# EAGLE design Mechaduino01 (EAGLE 7.3.0)
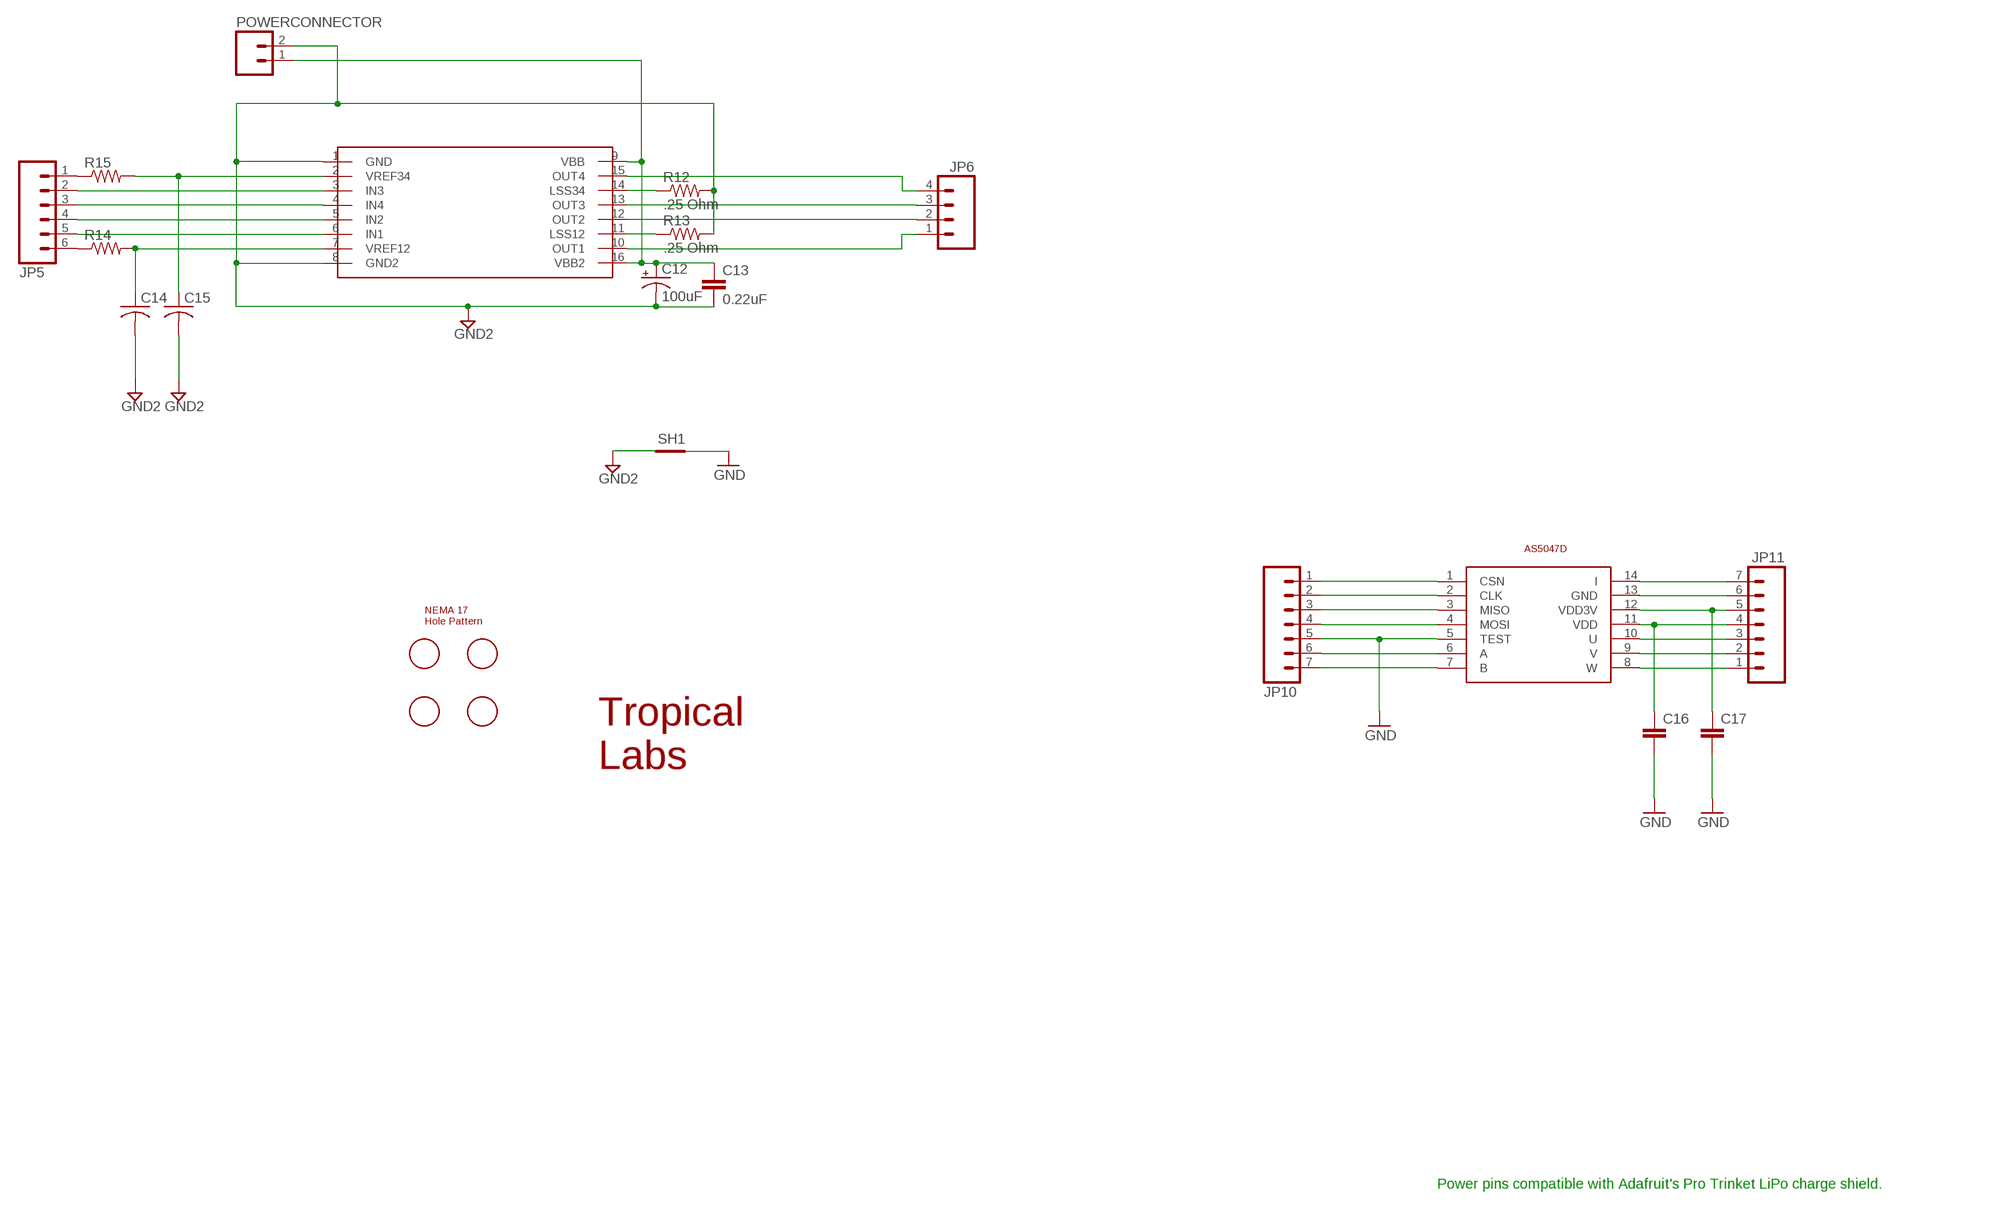
[diagram p0: schematic, sheet 1, part 1 of 2]
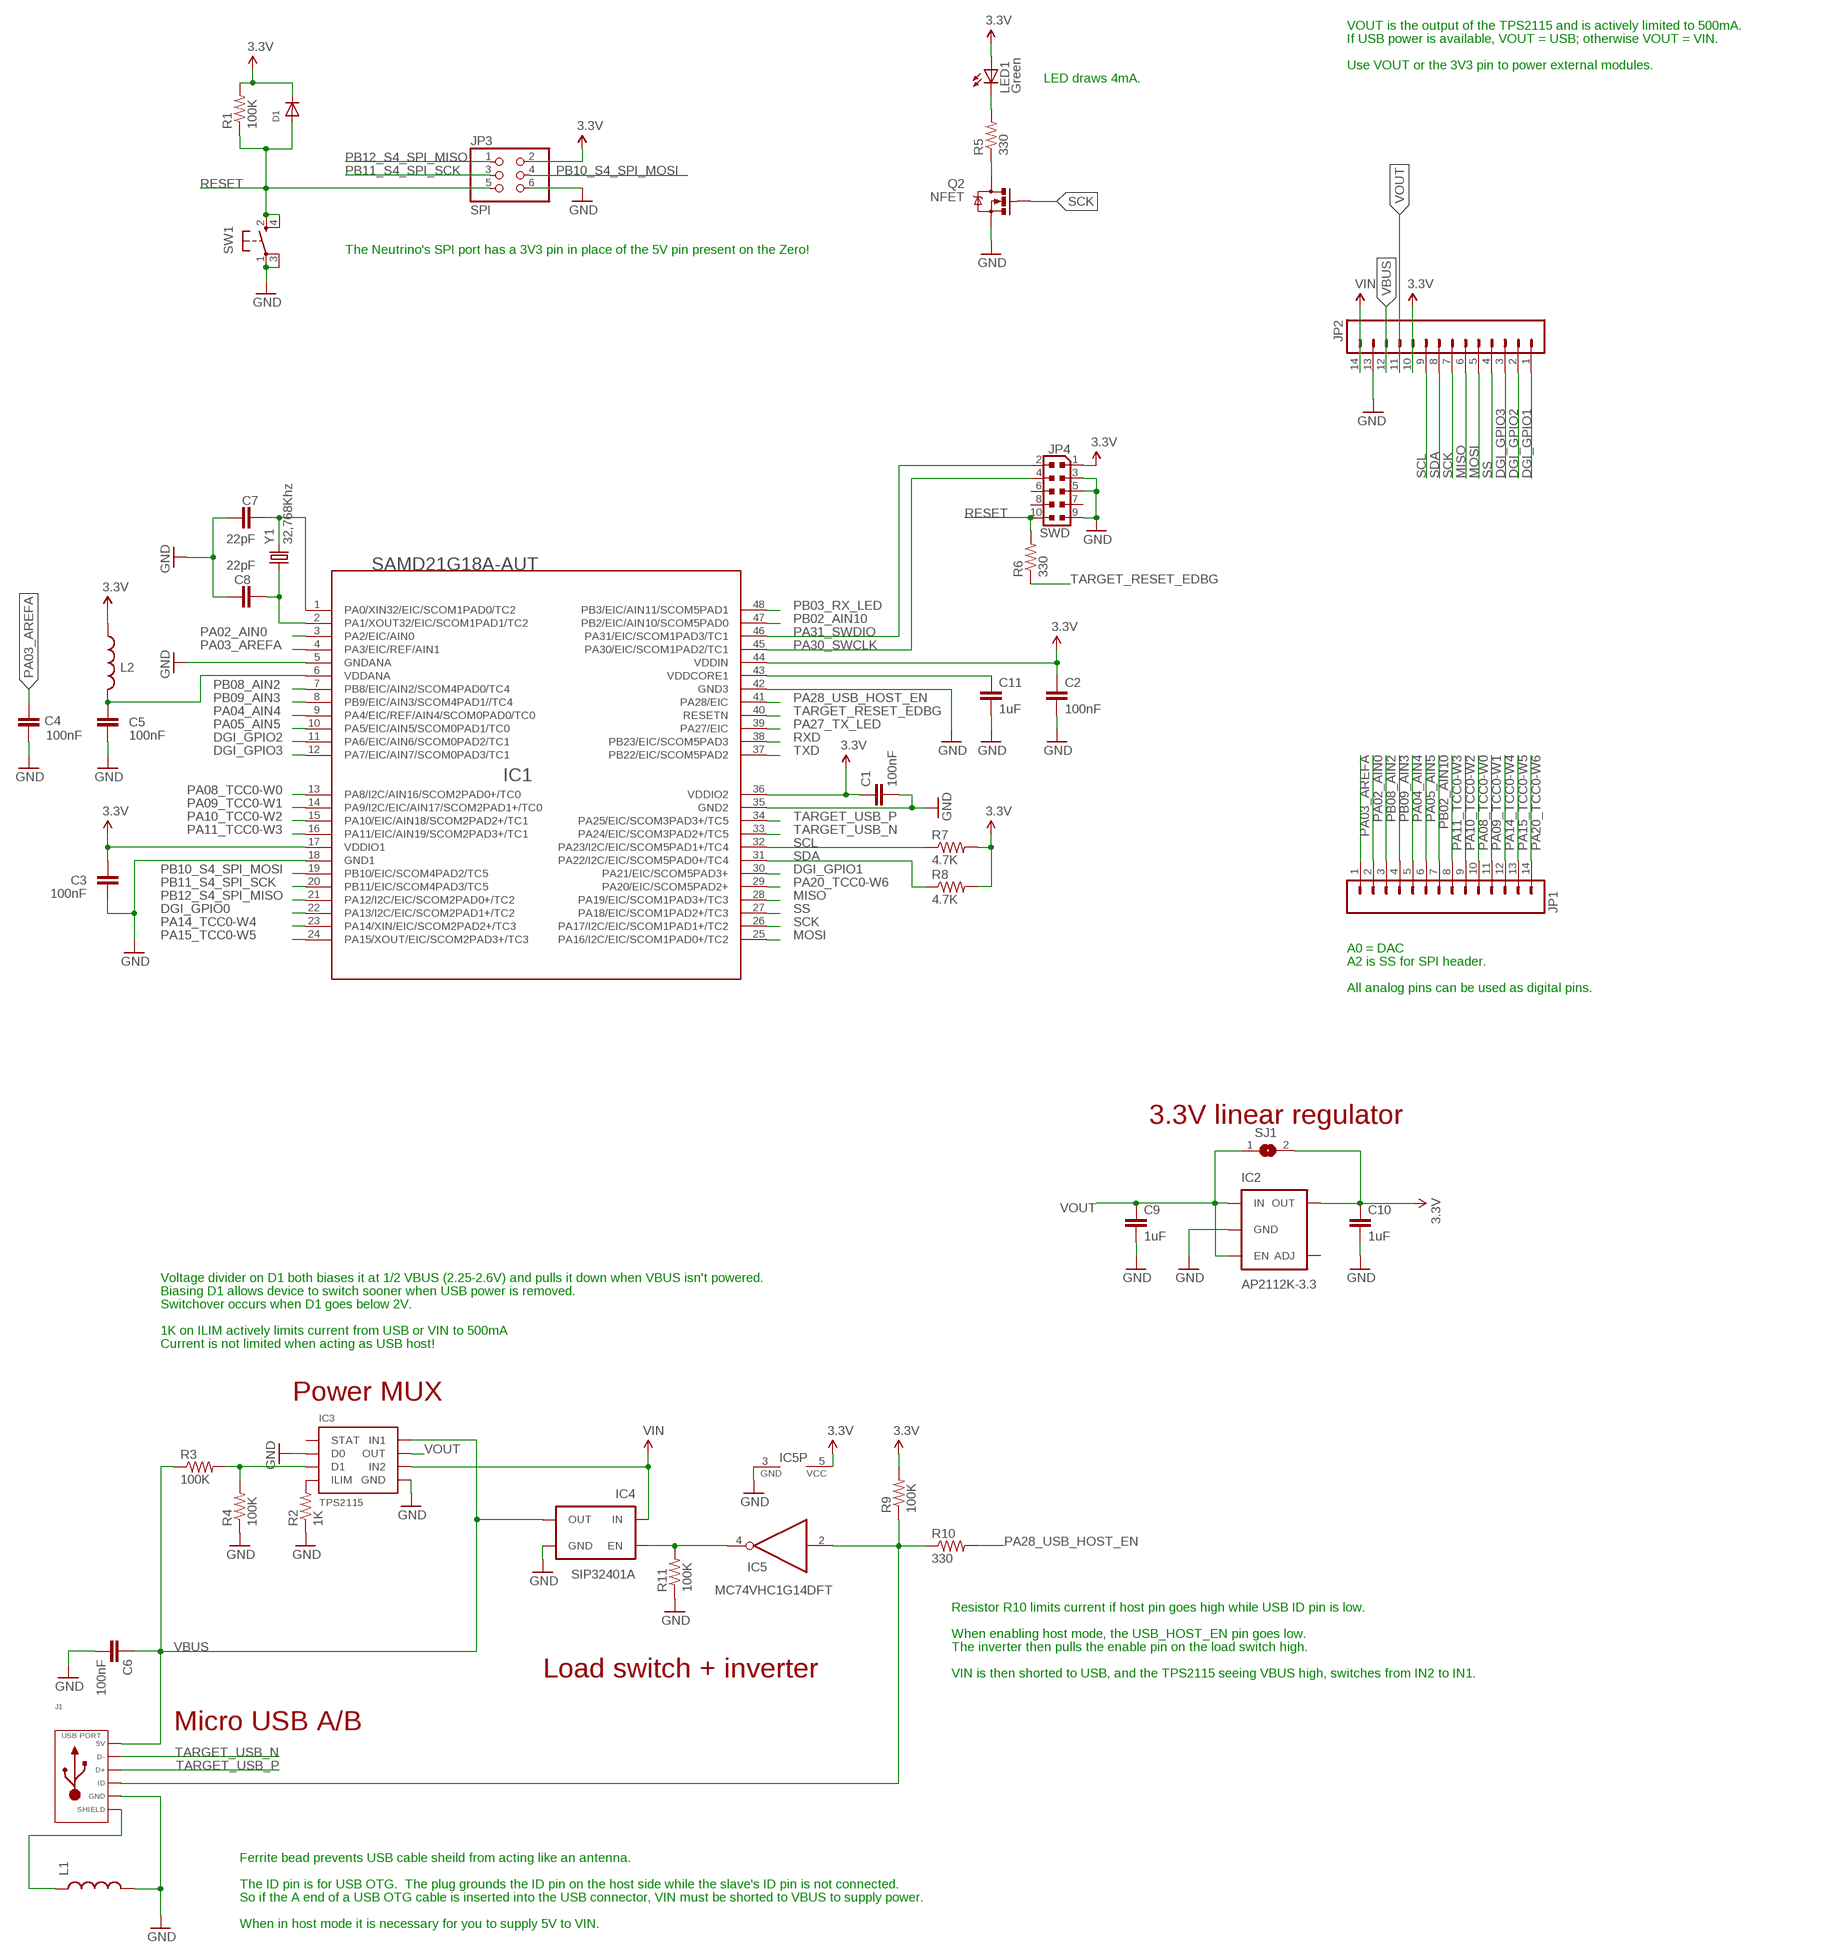
[diagram p1: schematic, sheet 1, part 2 of 2]

## Parts
C1  100nF  CAP0402  [0402-CAP]
C2  100nF  CAP0402  [0402-CAP]
C3  100nF  CAP0402  [0402-CAP]
C4  100nF  CAP0402  [0402-CAP]
C5  100nF  CAP0402  [0402-CAP]
C6  100nF  CAP0402  [0402-CAP]
C7  22pF  CAP0402  [0402-CAP]
C8  22pF  CAP0402  [0402-CAP]
C9  1uF  CAP0402  [0402-CAP]
C10  1uF  CAP0402  [0402-CAP]
C11  1uF  CAP0402  [0402-CAP]
C12  100uF  CAP_POLPTH1  [CPOL-RADIAL-100UF-25V]
C13  0.22uF  CAPEZ  [CAP-PTH-SMALLEZ]
C14  C-US050-035X075  [C050-035X075]
C15  C-US050-035X075  [C050-035X075]
C16  CAP0402  [0402-CAP]
C17  CAP0402  [0402-CAP]
D1  DIODESOD-523  [SOD-523]
IC1  SAMD21G18A-AUT  INTEGRATEDCIRCUITS_1792_SAMD21G18A-AUT  [INTEGRATEDCIRCUITS_TQFP48-7X7]
IC2  AP2112K-3.3  AP2202-ADJ  [SOT23-5]
IC3  TPS2115  [8-VDFN]
IC4  SIP32401A  [TDFN4]
IC5  MC74VHC1G14DFT  74AHC1G04DCK  [SC70-5]
J1  USB_MICRO_RIGHT  [MICROUSB-RIGHT]
JP1  M14NOSILK_SMALLPADS  [1X14_NO_SILK_SMALLPADS]
JP2  M14NOSILK_SMALLPADS  [1X14_NO_SILK_SMALLPADS]
JP3  SPI  CONNETTORI_0114_PH254-203DF118A00V  [CONNETTORI_2X03]
JP4  SWD  CONNETTORI_0171_PH127-205DF055G00A  [CONNETTORI_PINHEAD-2X5-P127]
JP5  M06SILK_FEMALE_PTH  [1X06]
JP6  M04PTH  [1X04]
JP10  M07  [1X07]
JP11  M07  [1X07]
L1  INDUCTOR0603-TDK  [0603-TDK]
L2  INDUCTOR0603-TDK  [0603-TDK]
LED1  Green  0044_KPT-2012YC  [CHIPLED_0805]
POWERCONNECTOR  M025MM  [SCREWTERMINAL-5MM-2]
Q2  NFET  MOSFET-NCHANNEL2N7002PW  [SOT323]
R1  100K  R-US_R0402-VISHAY  [R0402-VISHAY]
R2  1K  R-US_R0402-VISHAY  [R0402-VISHAY]
R3  100K  R-US_R0402-VISHAY  [R0402-VISHAY]
R4  100K  R-US_R0402-VISHAY  [R0402-VISHAY]
R5  330  R-US_R0402-VISHAY  [R0402-VISHAY]
R6  330  R-US_R0402-VISHAY  [R0402-VISHAY]
R7  4.7K  R-US_R0402-VISHAY  [R0402-VISHAY]
R8  4.7K  R-US_R0402-VISHAY  [R0402-VISHAY]
R9  100K  R-US_R0402-VISHAY  [R0402-VISHAY]
R10  330  R-US_R0402-VISHAY  [R0402-VISHAY]
R11  100K  R-US_R0402-VISHAY  [R0402-VISHAY]
R12  .25 Ohm  R-US_0204/2V  [0204V]
R13  .25 Ohm  R-US_0204/2V  [0204V]
R14  R-US_0204/2V  [0204V]
R15  R-US_0204/2V  [0204V]
SH1  SHORT-HA5  [SHORT_ALL-50]
SJ1  SJ  [SJ]
SW1  SPST_TACT-KMR2  [KMR2]
U$1  AVAGO_DRIVER  [TSSOP16]
U$2  NEMA17_HOLE_PATTERN  [NEMA17_HOLE_PATTERN]
U$3  TROPICAL_LABS_LOGO_1LOGO2  [LOGO2]
U$4  AS5047D  [TSSOP14]
Y1  32,768Khz  CRYSTAL2012  [CRYSTAL-SMD-2.0X1.2]

## Nets
3.3V: C1.1 C2.1 C3.2 C10.1 D1.K(C) IC1.17(VDDIO1) IC1.36(VDDIO2) IC1.44(VDDIN) IC2.5(OUT) IC5.5(VCC) JP2.10 JP3.2 JP4.1 L2.1 LED1.A R1.2 R7.2 R8.2 R9.2 SJ1.2
D1: IC3.3(D1) R3.2 R4.2
DGI_GPIO0: IC1.22(PA13/I2C/EIC/SCOM2PAD1+/TC2)
DGI_GPIO1: IC1.30(PA21/EIC/SCOM5PAD3+) JP2.1
DGI_GPIO2: IC1.11(PA6/EIC/AIN6/SCOM0PAD2/TC1) JP2.2
DGI_GPIO3: IC1.12(PA7/EIC/AIN7/SCOM0PAD3/TC1) JP2.3
GND [gnd]: C1.2 C2.2 C3.1 C4.2 C5.2 C6.2 C7.1 C8.1 C9.2 C10.2 C11.2 C16.2 C17.2 IC1.5(GNDANA) IC1.18(GND1) IC1.35(GND2) IC1.42(GND3) IC2.2(GND) IC3.2(D0) IC3.5(GND) IC3.P0(GND) IC3.V0(GND) IC3.V1(GND) IC3.V2(GND) IC3.V3(GND) IC3.V4(GND) IC4.0(GND) IC4.2(GND) IC5.3(GND) J1.5(GND) JP2.13 JP3.6 JP4.3 JP4.5 JP4.9 JP10.5 L1.2 Q2.2(S) R2.1 R4.1 R11.1 SH1.2 SW1.1(P) SW1.3(P1) U$4.5(TEST)
GND2 [gnd]: C12.2(-) C13.2 C14.2 C15.2 POWERCONNECTOR.2 R12.2 R13.2 SH1.1 U$1.1(GND) U$1.8(GND2)
IC4_EN: IC4.4(EN) IC5.4(O) R11.2
ILIM: IC3.4(ILIM) R2.2
MISO: IC1.28(PA19/EIC/SCOM1PAD3+/TC3) JP2.6
MOSI: IC1.25(PA16/I2C/EIC/SCOM1PAD0+/TC2) JP2.5
N$1: LED1.C R5.2
N$2: R12.1 U$1.14(LSS34)
N$3: Q2.3(D) R5.1
N$4: R13.1 U$1.11(LSS12)
N$5: C12.1(+) C13.1 POWERCONNECTOR.1 U$1.9(VBB) U$1.16(VBB2)
N$6: C15.1 R15.2 U$1.2(VREF34)
N$7: IC5.2(I) J1.4(ID) R9.1 R10.1
N$8: JP5.2 U$1.3(IN3)
N$9: JP5.3 U$1.4(IN4)
N$10: JP5.4 U$1.5(IN2)
N$11: JP5.5 U$1.6(IN1)
N$12: JP5.6 R14.1
N$13: JP6.4 U$1.15(OUT4)
N$14: JP6.1 U$1.10(OUT1)
N$15: JP6.2 U$1.12(OUT2)
N$16: JP6.3 U$1.13(OUT3)
N$17: JP10.1 U$4.1(CSN)
N$18: JP10.2 U$4.2(CLK)
N$19: JP10.3 U$4.3(MISO)
N$20: JP10.4 U$4.4(MOSI)
N$21: JP5.1 R15.1
N$22: JP10.6 U$4.6(A)
N$23: JP10.7 U$4.7(B)
N$24: JP11.1 U$4.8(W)
N$25: JP11.2 U$4.9(V)
N$26: JP11.3 U$4.10(U)
N$27: C16.1 JP11.4 U$4.11(VDD)
N$28: C17.1 JP11.5 U$4.12(VDD3V)
N$29: JP11.6 U$4.13(GND)
N$30: JP11.7 U$4.14(I)
N$32: C14.1 R14.2 U$1.7(VREF12)
PA00_XIN32: C7.2 IC1.1(PA0/XIN32/EIC/SCOM1PAD0/TC2) Y1.2
PA01_XOUT32: C8.2 IC1.2(PA1/XOUT32/EIC/SCOM1PAD1/TC2) Y1.1
PA02_AIN0: IC1.3(PA2/EIC/AIN0) JP1.2
PA03_AREFA: C4.1 IC1.4(PA3/EIC/REF/AIN1) JP1.1
PA04_AIN4: IC1.9(PA4/EIC/REF/AIN4/SCOM0PAD0/TC0) JP1.5
PA05_AIN5: IC1.10(PA5/EIC/AIN5/SCOM0PAD1/TC0) JP1.6
PA08_TCC0-W0: IC1.13(PA8/I2C/AIN16/SCOM2PAD0+/TC0) JP1.10
PA09_TCC0-W1: IC1.14(PA9/I2C/EIC/AIN17/SCOM2PAD1+/TC0) JP1.11
PA10_TCC0-W2: IC1.15(PA10/EIC/AIN18/SCOM2PAD2+/TC1) JP1.9
PA11_TCC0-W3: IC1.16(PA11/EIC/AIN19/SCOM2PAD3+/TC1) JP1.8
PA14_TCC0-W4: IC1.23(PA14/XIN/EIC/SCOM2PAD2+/TC3) JP1.12
PA15_TCC0-W5: IC1.24(PA15/XOUT/EIC/SCOM2PAD3+/TC3) JP1.13
PA20_TCC0-W6: IC1.29(PA20/EIC/SCOM5PAD2+) JP1.14
PA27_TX_LED: IC1.39(PA27/EIC)
PA28_USB_HOST_EN: IC1.41(PA28/EIC) R10.2
PA30_SWCLK: IC1.45(PA30/EIC/SCOM1PAD2/TC1) JP4.4
PA31_SWDIO: IC1.46(PA31/EIC/SCOM1PAD3/TC1) JP4.2
PB02_AIN10: IC1.47(PB2/EIC/AIN10/SCOM5PAD0) JP1.7
PB03_RX_LED: IC1.48(PB3/EIC/AIN11/SCOM5PAD1)
PB08_AIN2: IC1.7(PB8/EIC/AIN2/SCOM4PAD0/TC4) JP1.3
PB09_AIN3: IC1.8(PB9/EIC/AIN3/SCOM4PAD1//TC4) JP1.4
PB10_S4_SPI_MOSI: IC1.19(PB10/EIC/SCOM4PAD2/TC5) JP3.4
PB11_S4_SPI_SCK: IC1.20(PB11/EIC/SCOM4PAD3/TC5) JP3.3
PB12_S4_SPI_MISO: IC1.21(PA12/I2C/EIC/SCOM2PAD0+/TC2) JP3.1
RESET: D1.A JP3.5 JP4.10 R1.1 R6.2 SW1.2(S) SW1.4(S1)
RXD: IC1.38(PB23/EIC/SCOM5PAD3)
SCK: IC1.26(PA17/I2C/EIC/SCOM1PAD1+/TC2) JP2.7 Q2.1(G)
SCL: IC1.32(PA23/I2C/EIC/SCOM5PAD1+/TC4) JP2.9 R7.1
SDA: IC1.31(PA22/I2C/EIC/SCOM5PAD0+/TC4) JP2.8 R8.1
SHIELD [gnd]: J1.S1(SLD) J1.S2(SLD) J1.S3(SLD) J1.S4(SLD) J1.S5(SLD) J1.S6(SLD) J1.S7(SLD) J1.S8(SLD) L1.1
SS: IC1.27(PA18/EIC/SCOM1PAD2+/TC3) JP2.4
TARGET_RESET_EDBG: IC1.40(RESETN) R6.1
TARGET_USB_N [USBpair]: IC1.33(PA24/EIC/SCOM3PAD2+/TC5) J1.2(D-)
TARGET_USB_P [USBpair]: IC1.34(PA25/EIC/SCOM3PAD3+/TC5) J1.3(D+)
TXD: IC1.37(PB22/EIC/SCOM5PAD2)
VBUS [usbvcc]: C6.1 IC3.8(IN1) IC4.1(OUT) J1.1(5V) JP2.12 R3.1
VDDANA: C5.1 IC1.6(VDDANA) L2.2
VDDCORE: C11.1 IC1.43(VDDCORE1)
VIN [usbvcc]: IC3.6(IN2) IC4.3(IN) JP2.14
VOUT: C9.1 IC2.1(IN) IC2.3(EN) IC3.7(OUT) JP2.11 SJ1.1
Unconnected: IC2.4(ADJ) IC3.1(STAT) JP4.6 JP4.7 JP4.8

## Notes on the sheet
- Power pins compatible with Adafruit's Pro Trinket LiPo charge shield.
- VOUT is the output of the TPS2115 and is actively limited to 500mA.
- If USB power is available, VOUT = USB; otherwise VOUT = VIN.
- Use VOUT or the 3V3 pin to power external modules.
- LED draws 4mA.
- The Neutrino's SPI port has a 3V3 pin in place of the 5V pin present on the Zero!
- A0 = DAC
- A2 is SS for SPI header.
- All analog pins can be used as digital pins.
- 3.3V linear regulator
- Voltage divider on D1 both biases it at 1/2 VBUS (2.25-2.6V) and pulls it down when VBUS isn't powered.
- Biasing D1 allows device to switch sooner when USB power is removed.
- Switchover occurs when D1 goes below 2V.
- 1K on ILIM actively limits current from USB or VIN to 500mA
- Current is not limited when acting as USB host!
- Power MUX
- Resistor R10 limits current if host pin goes high while USB ID pin is low.
- When enabling host mode, the USB_HOST_EN pin goes low.
- The inverter then pulls the enable pin on the load switch high.
- Load switch + inverter | VIN is then shorted to USB, and the TPS2115 seeing VBUS high, switches from IN2 to IN1.
- Micro USB A/B
- Ferrite bead prevents USB cable sheild from acting like an antenna.
- The ID pin is for USB OTG.  The plug grounds the ID pin on the host side while the slave's ID pin is not connected.
- So if the A end of a USB OTG cable is inserted into the USB connector, VIN must be shorted to VBUS to supply power.
- When in host mode it is necessary for you to supply 5V to VIN.

## Library data of the parts
C1-C11 C16 C17 = swift:CAP: Capacitor Standard 0603 ceramic capacitor, and 0.1" leaded capacitor.
C12 = SparkFun-Capacitors:CAP_POL: Capacitor Polarized These are standard SMD and PTH capacitors. Normally 10uF, 47uF, and 100uF in electrolytic and tantalum varieties. Always verify the external diameter of the through hole cap, it varies with capacity, voltage, and manufacturer. The EIA devices should be standard.
C13 = SparkFun-Capacitors:CAP: Capacitor Standard 0603 ceramic capacitor, and 0.1" leaded capacitor.
C14 C15 = resistor:C-US: CAPACITOR, American symbol
D1 = adafruit:DIODE: Diode SMADIODE - SMA Surface Mount Package 20V 1A Schottky Diode Digikey: 641-1014-6-ND DO-1N4148 - Through Hole Small Current Diode SOD-123 20V 1 A (.5mV Vf) Schottky Diode - Digikey: MBRX120TPMSCT-ND SOD-323 10V 570mA (.38mV Vf, 3ns) Schottky Diode - Digikey: ZLLS410CT-ND SOD-523 30V 30mA Schottky Diode (RB751S-40TE61) - Digikey: RB751S-40TE61CT-ND SOT23-R/W - SOT23 Package (R = Solder Paste/Reflow Ovens, W = Hand-Soldering) BAT54Film 40V 300mA - Digikey: 497-7162-1-ND
IC1 = Arduino-Neutrino-082:INTEGRATEDCIRCUITS_1792_SAMD21G18A-AUT: Atmel D21 32bit ARM Cortex-M0 microcontroller - 48 PIN TQFP 256KB flash memory + 32KB SRAM
IC2 = SparkFun-PowerIC:AP2202-ADJ: AP2202 Adjustable LDO Diodes Inc small, low-cost LDO 150mA, 13.2V, less than 200mV dropout; PROD_ID: VREG-12189; VALUE: AP2202-ADJ
IC3 = swift:TPS2115
IC4 = swift:SIP32401A
IC5 = 74xx-little-us:74*1G04: INVERTER Gate
J1 = MF_Connectors:USB: Library: MF_Connectors Description: 5 Pin USB Connectors. SLD is the shield connection. Usually tied to ground through a small ferrite bead.
JP1 JP2 = SparkFun-Connectors:M14: Header 14 Standard 14-pin 0.1" header. Use with straight break away headers (SKU : PRT-00116), right angle break away headers (PRT-00553), swiss pins (PRT-00743), machine pins (PRT-00117), and female headers (PRT-00115).
JP3 = Arduino-Neutrino-082:CONNETTORI_0114_PH254-203DF118A00V: 3x2 M V h 8,5 mm p2,54; MONTHLY_USAGE: _____; PART_NUMBER: PH254-203DF118A00V; PRICE: _____; SUPPLIER: _____; TYPE: Connettori; VALUE: ICSP
JP4 = Arduino-Neutrino-082:CONNETTORI_0171_PH127-205DF055G00A: 2x5 PASSO 1,27; VALUE: PINHEAD-2x5-P1.27
JP5 = SparkFun-Connectors:M06: Header 6 Standard 6-pin 0.1" header. Use with straight break away headers (SKU : PRT-00116), right angle break away headers (PRT-00553), swiss pins (PRT-00743), machine pins (PRT-00117), and female headers (PRT-00115). Molex polarized connector foot print use with SKU : PRT-08094 with associated crimp pins and housings. NOTES ON THE VARIANTS LOCK and LOCK_LONGPADS... This footprint was designed to help hold the alignment of a through-hole component (i.e. 6-pin header) while soldering it into place. You may notice that each hole has been shifted either up or down by 0.005 of an inch from it's more standard position (which is a perfectly straight line). This slight alteration caused the pins (the squares in the middle) to touch the edges of the holes. Because they are alternating, it causes a "brace" to hold the component in place. 0.005 has proven to be the perfect amount of "off-center" position when using our standard breakaway headers. Although looks a little odd when you look at the bare footprint, once you have a header in there, the alteration is very hard to notice. Also,if you push a header all the way into place, it is covered up entirely on the bottom side. This idea of altering the position of holes to aid alignment will be further integrated into the Sparkfun Library for other footprints. It can help hold any component with 3 or more connection pins.; PROD_ID: CONN-08437
JP6 = SparkFun-Connectors:M04: Header 4 Standard 4-pin 0.1" header. Use with straight break away headers (SKU : PRT-00116), right angle break away headers (PRT-00553), swiss pins (PRT-00743), machine pins (PRT-00117), and female headers (PRT-00115). Molex polarized connector foot print use with SKU : PRT-08231 with associated crimp pins and housings. 1MM SMD Version SKU: PRT-10208
JP10 JP11 = SparkFun-Connectors:M07: Header 7 Standard 7-pin 0.1" header. Use with straight break away headers (SKU : PRT-00116), right angle break away headers (PRT-00553), swiss pins (PRT-00743), machine pins (PRT-00117), and female headers (PRT-00115). NOTES ON THE VARIANTS LOCK and LOCK_LONGPADS... This footprint was designed to help hold the alignment of a through-hole component (i.e. 7-pin header) while soldering it into place. You may notice that each hole has been shifted either up or down by 0.005 of an inch from it's more standard position (which is usually a perfectly straight line). This slight alteration caused the pins (the squares in the middle) to touch the edges of the holes. Because they are alternating, it causes a "brace" to hold the header in place. 0.005 has proven to be the perfect amount of "off-center" position when using our standard breakaway headers. Although looks a little odd when you look at the bare footprint, once you have a header in there, the alteration is very hard to notice. Also, if you push a header all the way into place, it is covered up entirely on the bottom side. This idea of altering the position of holes to aid alignment will be further integrated into the Sparkfun Library for other footprints. It can help hold any component with 3 or more connection pins.
L1 L2 = SparkFun-Passives:INDUCTOR: Inductors Basic Inductor/Choke - 0603 and 1206. Footprints are not proven and vary greatly between part numbers. SRN6045- 33uH, 20% 1.4A SDR0403-560KL - 56uH, 10%, 500mA RMS/740mA peak
LED1 = Opto:0044_KPT-2012YC: LED YELLOW - SMD - 0805; MONTHLY_USAGE: _____; PART_NUMBER: KPT-2012YC; PRICE: _____; SUPPLIER: _____; TYPE: Opto; VALUE: Yellow
POWERCONNECTOR = SparkFun-Connectors:M02: Standard 2-pin 0.1" header. Use with - straight break away headers ( PRT-00116) - right angle break away headers (PRT-00553) - swiss pins (PRT-00743) - machine pins (PRT-00117) - female headers (PRT-00115) Molex polarized connector foot print use with: PRT-08233 with associated crimp pins and housings. 2.54_SCREWTERM for use with PRT-10571. 3.5mm Screw Terminal footprints for PRT-08084 5mm Screw Terminal footprints for use with PRT-08432; STOREFRONT_ID: PRT-08432
Q2 = SparkFun-DiscreteSemi:MOSFET-NCHANNEL: Common NMOSFET Parts MFG P/N Store ID Prod ID FDD8780 TRANS-09984 SI7820DN TRANS-11055 FDS6630A IC-08089 2N7002PW TRANS-11151 FQP30N06L COM-10213 TRANS-10060 BSS123LT1G TRANS-08345 BSS138 TRANS-00830 BS170 2N7000; PROD_ID: TRANS-11151
R1-R11 = adafruit:R-US_: RESISTOR, American symbol
R12-R15 = resistor:R-US_: RESISTOR, American symbol
SH1 = shorts-old:SHORT-H: Short between two nets; BOM: no
SJ1 = jumper:SJ: SMD solder JUMPER
SW1 = adafruit:SPST_TACT: SMT 6mm switch, EVQQ2 series http://www.ladyada.net/library/eagle
U$1 = avagopack:AVAGO_DRIVER
U$2 = stepper_servo_prototype_1:NEMA17_HOLE_PATTERN
U$3 = stepper_servo_prototype_1:TROPICAL_LABS_LOGO_1
U$4 = stepper_servo_prototype_1:AS5047D
Y1 = SparkFun-FreqCtrl:CRYSTAL: Various standard crystals. Proven footprints. Spark Fun Electronics SKU : COM-00534

## Net classes
2 gnd: width 0.152 mm, drill 0.305 mm, clearance 0.152 mm
3 usbvcc: width 0.152 mm, drill 0.305 mm, clearance 0.152 mm
4 USBpair: width 0.152 mm, drill 0.305 mm, clearance 0.152 mm

## Board
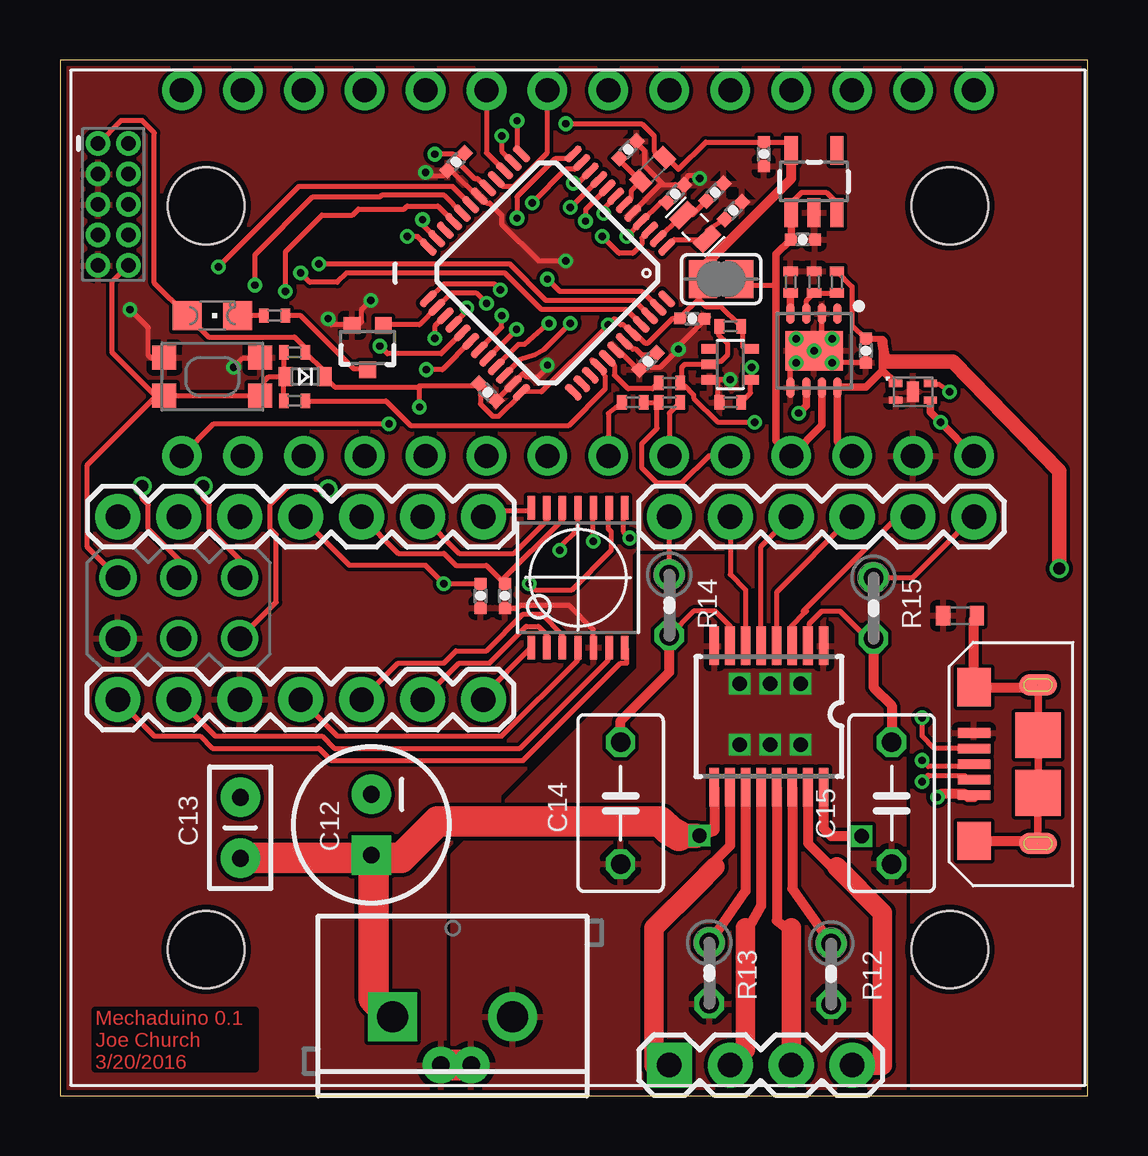
[diagram p2: board, top side]
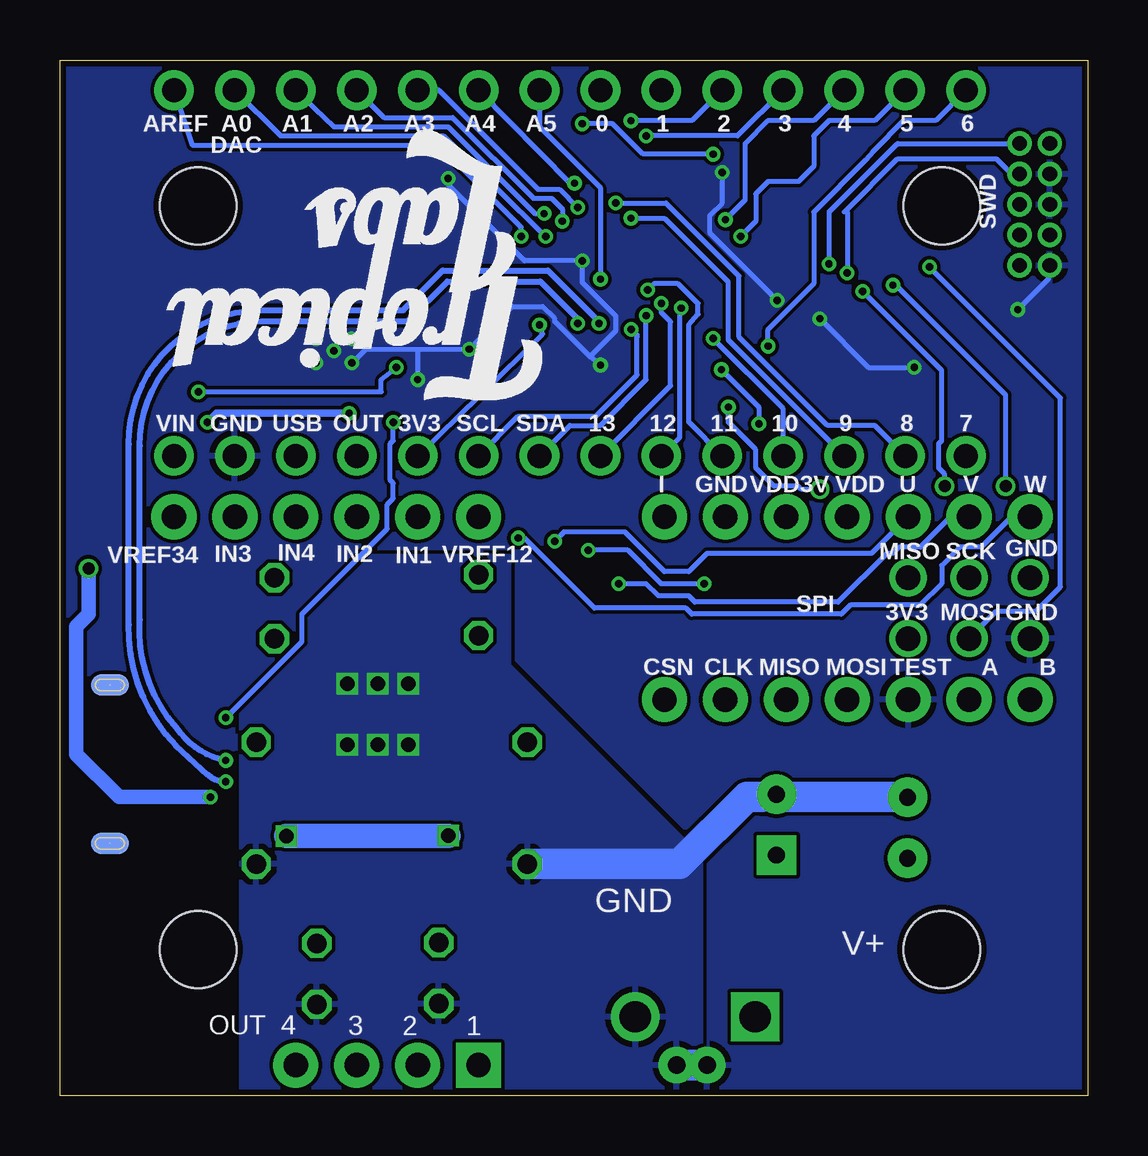
[diagram p3: board, bottom side, seen from below]

Size 42.85 x 43.17 mm. Coordinates in mm from the lower left corner, seen from the top.
Outline: 0,0 42.85,0 42.85,43.17 0,43.17 0,0
Copper layers (1*16): Top 0.035mm / dielectric 0.2mm / Bottom 0.035mm
Design rules "MacroFabDRU": minimum track width 6mil, minimum drill 12mil, track to track 6mil, track to pad 6mil, pad to pad 6mil, via to via 6mil, smd to smd 0mil, copper to edge 10mil, drill to drill 10mil, minimum pad ring 6mil, minimum via ring 6mil, stop-mask expansion 2mil, vias tented up to drill 25mil, thermal gap 10mil

### Footprints (pad centres in the part's own frame; a part is rotated, then mirrored left to right if it is on the bottom)
0402-CAP = smd 0.5 x 0.5: 1 -0.5,0; 2 0.5,0
CPOL-RADIAL-100UF-25V = drill 0.7 pad 1.651 square: 1 1.27,0 | drill 0.7 pad 1.651: 2 -1.27,0
CAP-PTH-SMALLEZ = drill 0.7 pad 1.651: 1 0,0; 2 2.54,0
C050-035X075 = drill 0.813 octagon: 1 -2.54,0; 2 2.54,0
SOD-523 = smd 0.8 x 0.6: A 0,-0.8; K 0,0.8
INTEGRATEDCIRCUITS_TQFP48-7X7 = smd 0.85 x 0.32: 1 -4.275,2.75; 2 -4.275,2.25; 3 -4.275,1.75; 4 -4.275,1.25; 5 -4.275,0.75; 6 -4.275,0.25; 7 -4.275,-0.25; 8 -4.275,-0.75; 9 -4.275,-1.25; 10 -4.275,-1.75; 11 -4.275,-2.25; 12 -4.275,-2.75; 25 4.275,-2.75; 26 4.275,-2.25; 27 4.275,-1.75; 28 4.275,-1.25; 29 4.275,-0.75; 30 4.275,-0.25; 31 4.275,0.25; 32 4.275,0.75; 33 4.275,1.25; 34 4.275,1.75; 35 4.275,2.25; 36 4.275,2.75 | smd 0.32 x 0.85: 13 -2.75,-4.275; 14 -2.25,-4.275; 15 -1.75,-4.275; 16 -1.25,-4.275; 17 -0.75,-4.275; 18 -0.25,-4.275; 19 0.25,-4.275; 20 0.75,-4.275; 21 1.25,-4.275; 22 1.75,-4.275; 23 2.25,-4.275; 24 2.75,-4.275; 37 2.75,4.275; 38 2.25,4.275; 39 1.75,4.275; 40 1.25,4.275; 41 0.75,4.275; 42 0.25,4.275; 43 -0.25,4.275; 44 -0.75,4.275; 45 -1.25,4.275; 46 -1.75,4.275; 47 -2.25,4.275; 48 -2.75,4.275
SOT23-5 = smd 0.55 x 1.2: 1 -0.95,-1.3; 2 0,-1.3; 3 0.95,-1.3; 4 0.95,1.3; 5 -0.95,1.3
8-VDFN = smd 0.35 x 0.85: 1 -0.975,-1.545; 2 -0.325,-1.545; 3 0.325,-1.545; 4 0.975,-1.545; 5 0.975,1.545; 6 0.325,1.545; 7 -0.325,1.545; 8 -0.975,1.545 | smd 2.4 x 1.65: P0 0,0 | drill 0.305 pad 0.61: V0 -0.75,0.5; V1 0.75,0.5; V2 0,0; V3 -0.75,-0.5; V4 0.75,-0.5
TDFN4 = smd 0.86 x 0.5: 0 0,0 | smd 0.3 x 0.55: 1 -0.35,-0.725; 2 0.35,-0.725; 3 0.35,0.725; 4 -0.35,0.725
SC70-5 = smd 0.4 x 0.7: 1 -0.65,-0.85; 2 0,-0.85; 3 0.65,-0.85; 4 0.65,0.85; 5 -0.65,0.85
MICROUSB-RIGHT = smd 0.4 x 1.35: 1 -1.3,1.27; 2 -0.65,1.27; 3 0,1.27; 4 0.65,1.27; 5 1.3,1.27 | smd 0.9 x 1.6: S1 -3.3,-1.4; S2 3.3,-1.4 | smd 1.6 x 1.4: S3 -3.2,1.27; S4 3.2,1.27 | smd 1.9 x 1.9: S5 -1.2,-1.405; S6 1.2,-1.405 | smd 0.9 x 1.6 bottom: S7 -3.3,-1.4; S8 3.3,-1.4
1X14_NO_SILK_SMALLPADS = drill 1 pad 1.65: 1 -16.51,0; 2 -13.97,0; 3 -11.43,0; 4 -8.89,0; 5 -6.35,0; 6 -3.81,0; 7 -1.27,0; 8 1.27,0; 9 3.81,0; 10 6.35,0; 11 8.89,0; 12 11.43,0; 13 13.97,0; 14 16.51,0
CONNETTORI_2X03 = drill 1.016 pad 1.55: 1 -2.54,-1.27; 2 -2.54,1.27; 3 0,-1.27; 4 0,1.27; 5 2.54,-1.27; 6 2.54,1.27
CONNETTORI_PINHEAD-2X5-P127 = drill 0.61 pad 1.016: 1 -0.635,2.54; 2 0.635,2.54; 3 -0.635,1.27; 4 0.635,1.27; 5 -0.635,0; 6 0.635,0; 7 -0.635,-1.27; 8 0.635,-1.27; 9 -0.635,-2.54; 10 0.635,-2.54
1X06 = drill 1.016 pad 1.88: 1 0,0; 2 2.54,0; 3 5.08,0; 4 7.62,0; 5 10.16,0; 6 12.7,0
1X04 = drill 1.016 pad 1.88 square: 1 0,0 | drill 1.016 pad 1.88: 2 2.54,0; 3 5.08,0; 4 7.62,0
1X07 = drill 1.016 pad 1.88: 1 0,0; 2 2.54,0; 3 5.08,0; 4 7.62,0; 5 10.16,0; 6 12.7,0; 7 15.24,0
0603-TDK = smd 0.6 x 0.8: 1 -0.7,0; 2 0.7,0
CHIPLED_0805 = smd 1.2 x 1.2: A 0,-1.05; C 0,1.05
SCREWTERMINAL-5MM-2 = drill 1.3 pad 2.032 square: 1 0,0 | drill 1.3 pad 2.032: 2 5,0
SOT323 = smd 0.7 x 0.7: 1 -0.65,-0.925; 2 0.65,-0.925; 3 0,0.925
R0402-VISHAY = smd 0.4 x 0.6: 1 -0.45,0; 2 0.45,0
0204V = drill 0.813 octagon: 1 -1.27,0; 2 1.27,0
SHORT_ALL-50 = drill 0.737 pad 1.524: 1 -0.635,0; 2 0.635,0
SJ = smd 1.168 x 1.6: 1 -0.762,0; 2 0.762,0
KMR2 = smd 1 x 1: 1 2,0.8; 2 2,-0.8; 3 -2,0.8; 4 -2,-0.8
TSSOP16 = smd 0.4 x 1.6: 1 -2.225,-2.85; 2 -1.575,-2.85; 3 -0.925,-2.85; 4 -0.275,-2.85; 5 0.375,-2.85; 6 1.025,-2.85; 7 1.675,-2.85; 8 2.325,-2.85; 9 2.325,3.05; 10 1.675,3.05; 11 1.025,3.05; 12 0.375,3.05; 13 -0.275,3.05; 14 -0.925,3.05; 15 -1.575,3.05; 16 -2.225,3.05
NEMA17_HOLE_PATTERN = hole 3.2: -15.5,15.5; -15.5,-15.5; 15.5,-15.5; 15.5,15.5
TSSOP14 = smd 0.305 x 0.991: 1 -1.95,-2.918; 2 -1.3,-2.918; 3 -0.65,-2.918; 4 0,-2.918; 5 0.65,-2.918; 6 1.3,-2.918; 7 1.95,-2.918; 8 1.95,2.918; 9 1.3,2.918; 10 0.65,2.918; 11 0,2.918; 12 -0.65,2.918; 13 -1.3,2.918; 14 -1.95,2.918
CRYSTAL-SMD-2.0X1.2 = smd 0.6 x 1.1: 1 -0.7,0; 2 0.7,0

### Placement (x,y rotation side)
C1  17.82,29.32 315 top
C2  26.35,32.38 358.8 top
C3  16.51,38.93 45 top
C4  25.65,37.59 45 top
C5  23.69,39.43 45 top
C6  33.59,31.05 270 top
C7  28.07,36.89 225 top
C8  27.3,37.66 225 top
C9  30.96,35.69 0 top
C10  29.34,39.24 270 top
C11  24.51,30.61 225 top
C12  12.98,11.29 270 top
C13  7.52,9.89 90 top
C14  23.37,12.19 270 top
C15  34.67,12.19 270 top
C16  17.53,20.83 270 top
C17  18.54,20.83 270 top
D1  10.22,29.97 270 top
IC1  20.32,34.29 225 top
IC2  31.43,38.1 0 top
IC3  31.43,31.05 180 top
IC4  35.56,29.34 270 top
IC5  27.94,30.48 270 top
J1  39.37,13.82 90 top
JP1  21.59,41.91 180 top
JP2  21.59,26.67 0 top
JP3  4.95,20.32 180 top
JP4  2.22,37.15 0 top
JP5  38.1,24.13 180 top
JP6  25.4,1.27 0 top
JP10  17.65,16.51 180 top
JP11  2.41,24.13 0 top
L1  37.52,20.01 180 top
L2  24.7,38.61 225 top
LED1  6.35,32.51 270 top
POWERCONNECTOR  13.87,3.29 0 top
Q2  12.83,31.18 180 top
R1  9.78,30.99 0 top
R2  30.45,33.91 270 top
R3  32.38,33.91 270 top
R4  31.43,33.91 270 top
R5  8.95,32.51 180 top
R6  9.78,28.96 180 top
R7  25.4,28.89 180 top
R8  23.88,28.89 0 top
R9  27.94,32.07 0 top
R10  25.4,29.72 180 top
R11  27.94,28.89 0 top
R12  32.14,5.07 270 top
R13  27.06,5.11 270 top
R14  25.4,20.45 270 top
R15  33.91,20.32 270 top
SH1  16.51,1.27 180 top
SJ1  27.56,34.04 180 top
SW1  6.35,29.97 0 top
U$1  29.6,15.9 180 top
U$2  21.59,21.59 0 top
U$3  22.48,40.51 180 bottom
U$4  21.59,21.59 0 top
Y1  26.48,36.21 315 top

### Tracks (layer width: path | path; a pad name or v marks a point on that pad's centre or on a via)
3.3V  (via drill 0.3, 0.3 pad 0.25, 0.5 pad 0.25)
  Top 0.203: JP4.1 2.54,40.64 3.43,40.64 3.94,40.13 3.94,33.88 LED1.A 6.19,31.62 9.78,31.62 10.23,31.17 R1.2 11.02,30.19 D1.K 11.45,29.55 14.99,29.55 | 14.99,29.55 14.99,29.59 17.39,29.59 C1.1 17.53,29.72 17.78,29.46 17.53,29.21 17.53,28.83 18.03,28.32 18.29,28.32 19.18,29.21 IC1.36 20.07,29.34 22.67,31.94 v22.86,32.13 23.11,32.38 23.37,32.13 23.5,32.13 23.75,31.88 IC1.44 23.88,31.88 24.38,31.37 24.51,31.37 25.53,32.38 25.78,32.38 C2.1 25.91,32.51 26.61,33.21 | v14.99,28.7 14.99,29.55 | v11.18,25.27 10.67,25.27 10.54,25.4 9.53,25.4 8.76,24.64 8.76,23.62 9.02,23.37 9.02,20.57 JP3.2 | 16.57,39.05 16.76,39.24 C3.2 | 16.57,39.05 16.51,38.99 17.27,38.23 17.4,38.23 17.78,37.85 IC1.17 | JP2.10 27.05,26.67 25.91,25.53 24.89,25.53 24.26,26.16 24.26,27.18 24.89,27.81 24.89,28.83 R7.2 R8.2 | IC5.5 28.7,31.11 28.57,31.11 28.45,31.24 28.45,32 R9.2 28.32,32.13 27.56,32.89 26.92,32.89 26.61,33.21 | C10.1 26.92,39.75 25.78,38.61 25.27,39.12 L2.1 25.15,39.12 25.02,39.12 24.77,39.37 24.77,40.01 24.26,40.51 v21.08,40.51 | C10.1 30.35,39.75 30.48,39.62 30.48,39.5 IC2.5 | C10.1 | v15.62,39.24 16.38,39.24 16.57,39.05 | SJ1.2 26.8,33.4 26.61,33.21
  Top 0.406: SJ1.2 26.8,34.54 30.48,38.23 30.48,39.37 IC2.5
  Bottom 0.203: v14.99,28.7 14.99,28.07 13.84,26.92 13.84,26.16 13.08,25.4 12.06,25.4 11.94,25.27 v11.18,25.27 | JP2.10 22.73,31.75 v22.86,32.13 | v21.08,40.51 19.81,40.51 18.54,39.24 v15.62,39.24
D1
  Top 0.203: IC3.3 31.11,33.14 R4.2 R3.2
DGI_GPIO1  (via drill 0.3)
  Top 0.203: JP2.1 6.41,28 v13.72,28 | IC1.30 15.94,30.26 v15.28,30.26
  Bottom 0.203: v13.72,28 13.72,28.7 v15.28,30.26
DGI_GPIO2  (via drill 0.3)
  Top 0.203: IC1.11 21.46,38.61 21.08,38.61 v19.68,37.21
  Top 0.254: IC1.11
  Bottom 0.203: JP2.2 8.89,27.94 10.86,27.94 14.54,31.62 14.54,34.16 17.59,37.21 v19.68,37.21
DGI_GPIO3  (via drill 0.3)
  Top 0.203: IC1.12 21.21,39.05 20.64,39.05 19.05,37.47 v19.05,36.58
  Bottom 0.203: JP2.3 14.99,31.5 14.99,33.91 17.65,36.58 v19.05,36.58
GND  (via drill 0.3, 0.3 pad 0.25)
  Top 0.203: v2.92,32.77 3.68,32 3.68,30.86 3.81,30.73 4.32,30.73 SW1.3 | v7.24,30.35 7.62,30.73 8.26,30.73 SW1.1 | v11.18,32.38 11.18,32.26 11.3,32.13 12.06,32.13 Q2.2 12.19,32.13 12.45,32.13 12.57,32.26 12.57,32.77 v12.95,33.15 | U$4.5 22.23,18.8 22.23,19.43 21.21,20.45 19.18,20.45 19.05,20.32 C17.2 | 27.43,29.84 27.18,29.84 IC5.3 27.43,29.84 | 27.43,29.84 27.43,28.96 R11.1 | IC1.42 23.24,30.99 23.37,30.99 24.13,30.23 C11.2 24.38,30.48 24.51,30.48 24.64,30.35 25.02,30.35 v25.78,31.11 25.65,31.11 26.8,32.26 C2.2 | 25.15,37.97 25.02,37.97 23.88,36.83 IC1.5 | 25.15,37.97 25.65,37.97 C4.2 26.16,38.35 26.54,38.35 v26.67,38.23 | 25.15,37.97 24.38,38.73 24.38,39.37 24.13,39.62 C5.2 | v21.08,34.8 19.94,34.8 18.41,36.32 18.41,36.7 17.91,37.21 17.78,37.21 17.53,37.47 IC1.18 17.4,37.47 16.38,38.48 16.26,38.48 C3.1 16.13,38.48 16,38.35 15.37,38.35 v15.24,38.48 | IC3.5 30.46,30.33 IC3.V1 | C1.2 18.29,29.08 18.8,29.59 IC1.35 18.92,29.72 19.3,30.1 19.43,29.97 19.94,29.97 20.26,30.29 | C6.2 IC3.V0 | 31.75,31.75 31.95,31.55 IC3.V3 32.13,31.5 31.75,31.11 31.5,31.11 IC3.V2 31.75,31.75 | v27.94,29.84 27.43,29.84 | 20.26,30.29 v20.32,30.45 20.19,30.35 20.26,30.29 | 31.75,31.75 31.75,32.51 IC3.2
  Bottom 0.203: v2.92,32.77 1.65,34.04 1.65,34.54 JP4.9 | v7.24,30.35 9.14,30.35 v11.18,32.38 | v26.67,38.23 26.67,37.97 23.5,34.8 v21.08,34.8 21.08,33.91 19.68,32.51 19.68,31.88 20.77,30.8 | 27.94,31.11 30.1,31.11 30.61,30.61 IC3.V1 | 27.94,31.11 v25.78,31.11 24,32.89 22.73,32.89 22.23,32.38 22.23,32.26 20.77,30.8 | 27.94,31.11 v27.94,29.84 | v20.32,30.45 20.77,30.8 | v15.24,38.48 15.24,37.21 15.75,36.7 15.75,35.94 v12.95,33.15
  pour Bottom (rank 2): 0,0 0,43.18 43.18,43.18 43.18,0
  pour Top (rank 2): 0,43.18 43.18,43.18 43.18,0 0,0
GND2  (via drill 0.6)
  Bottom 1.27: C13.2 7.62,12.45 12.95,12.45 C12.2 13.59,12.45 14.22,12.45 17.02,9.65 C14.2
  other vias: 30.87,17.17 30.87,14.63 29.6,17.17 28.33,17.17 28.33,14.63 29.6,14.63
  pour Top: 16.38,0 16.38,10.03 24.13,17.78 24.13,22.35 24.26,22.48 35.18,22.48 35.18,0
  pour Bottom: 16.13,0 16.13,9.91 24.13,17.91 24.13,22.48 35.31,22.48 35.31,0.13 35.31,0
IC4_EN  (via drill 0.3)
  Top 0.203: IC4.4 36.39,29.65 36.64,29.65 v37.08,29.34 | R11.2 28.79,29.29 IC5.4 28.53,29.83 28.83,30.04 v28.83,30.35
  Bottom 0.203: v37.08,29.34 29.46,29.34 29.46,29.84 v28.83,30.35
ILIM
  Top 0.305: IC3.4 30.46,33.44 R2.2
MISO  (via drill 0.3)
  Top 0.203: IC1.28 16.95,32.69 v16.95,32.83
  Bottom 0.203: v16.95,32.83 17.02,32.77 17.02,27.43 JP2.6
MOSI  (via drill 0.3)
  Top 0.203: IC1.25 16,33.85 18.1,33.85 v18.35,33.59
  Bottom 0.203: JP2.5 16.64,28.07 16.64,32.13 16.26,32.58 16.26,33.02 17.08,33.85 18.1,33.85 v18.35,33.59
N$1
  Top 0.203: R5.2 LED1.C
N$2
  Top 0.406: U$1.14 30.53,8.62 R12.1
N$3
  Top 0.203: Q2.3 12.8,30.29 12.26,30.29 10.03,32.51 R5.1 9.47,32.32
N$4
  Top 0.406: U$1.11 28.58,8.53 R13.1
N$5  (via drill 0.6)
  Top 0.406: U$1.16 31.83,11.13 32.14,10.82 v33.41,10.82 | U$1.9 27.28,11.04 v26.66,10.83 26.48,10.82
  Top 1.016: 25.79,10.82 26.48,10.82
  Top 1.27: C12.1 13.08,9.91 13.08,4.06 13.84,3.3 POWERCONNECTOR.1 | C13.1 7.62,9.91 12.45,9.91 C12.1 | 25.79,10.82 25.4,11.05 25.02,11.43 15.75,11.43 14.22,9.91 13.72,9.91 C12.1
  Bottom 1.016: v26.66,10.83 v33.41,10.82
N$6
  Top 0.203: R15.2 33.66,19.05 32.51,20.19 31.75,20.19 31.24,19.68 31.24,18.8 U$1.2
  Top 0.406: R15.2 33.91,17.02 34.67,16.26 C15.1
N$7  (via drill 0.3)
  Top 0.152: J1.4
  Top 0.203: R9.1 27.43,32 27.43,31.75 27.81,31.37 27.81,30.86 27.56,30.61 27.43,30.61 27.3,30.48 IC5.2 26.04,30.48 25.91,30.35 25.91,29.72 R10.1 25.78,29.72 25.91,29.59 26.04,29.59 26.42,29.21 26.42,29.08 27.43,28.07 v28.96,28.07 | 38.23,14.48 J1.4 36.45,14.48 35.94,14.99 v35.94,15.75
  Bottom 0.203: v28.96,28.07 28.96,27.3 29.08,27.18 29.08,25.65 28.96,25.53 28.96,24.89 29.21,24.64 29.21,23.62 32.77,20.07 32.77,18.92 v35.94,15.75
N$8
  Top 0.203: 31.05,20.13 30.48,19.56 30.48,18.8 U$1.3 | 31.05,20.13 31.11,20.19 | JP5.2 34.92,24.13 30.99,20.19 31.05,20.13
N$9
  Top 0.203: U$1.4 29.88,20.99 JP5.3
N$10
  Top 0.203: U$1.5 29.23,22.88 JP5.4
N$11
  Top 0.203: JP5.5 27.94,21.72 28.57,21.08 U$1.6
N$12
  Top 0.203: R14.1 JP5.6
N$13
  Top 0.203: 32.38,9.53 32.26,9.4 32.14,9.55
  Top 0.406: U$1.15 31.18,10.52 32.14,9.55
  Top 0.813: JP6.4 34.29,1.27 34.29,7.62 32.38,9.53
N$14
  Top 0.203: 26.54,8.76 26.43,8.91
  Top 0.406: U$1.10 27.93,10.41 26.43,8.91
  Top 0.813: JP6.1 24.77,1.27 24.77,6.99 26.54,8.76 27.3,9.53
N$15
  Top 0.203: 28.57,6.86 28.71,7.01
  Top 0.406: U$1.12 29.23,7.91 28.71,7.01
  Top 0.813: JP6.2 28.57,1.91 28.57,6.86 28.57,6.99
N$16
  Top 0.203: 30.48,6.86 30.35,6.86 30.24,7.01
  Top 0.406: U$1.13 29.88,7.29 30.24,7.01
  Top 0.813: JP6.3 30.48,6.86 30.48,6.99
N$17
  Top 0.203: JP10.1 17.65,16.68 U$4.1
N$18
  Top 0.203: JP10.2 16.64,18.03 17.91,18.03 19.43,19.56 19.94,19.56 20.32,19.18 20.32,18.8 U$4.2
N$19
  Top 0.203: JP10.3 14.1,18.03 16,18.03 16.51,18.54 17.78,18.54 19.3,20.07 20.07,20.07 20.95,19.18 20.95,18.8 U$4.3
N$20
  Top 0.203: U$4.4 21.59,18.16 18.41,14.99 11.56,14.99 JP10.4
N$21
  Top 0.203: JP5.1 35.56,21.59 R15.1
N$22
  Top 0.203: JP10.6 6.48,14.99 10.92,14.99 11.43,14.48 19.18,14.48 22.86,18.16 22.86,18.67 U$4.6
N$23
  Top 0.203: U$4.7 23.62,18.59 23.62,18.03 23.37,18.03 19.3,13.97 11.3,13.97 10.79,14.48 6.35,14.48 5.84,14.99 3.94,14.99 JP10.7
N$24  (via drill 0.3 pad 0.25)
  Top 0.203: v23.75,23.24 23.5,23.5 23.5,24.38 U$4.8
  Bottom 0.203: v23.75,23.24 23.5,23.24 20.57,20.32 16.76,20.32 16.51,20.07 10.29,20.07 9.91,20.45 6.99,20.45 6.1,21.34 6.1,22.1 5.33,22.86 4.45,22.86 3.17,24.13 JP11.1
N$25  (via drill 0.3 pad 0.25)
  Top 0.203: v19.56,21.34 19.81,21.08 21.34,21.08 22.99,22.73 22.99,23.5 22.86,23.62 22.86,24.38 U$4.9
  Bottom 0.203: v19.56,21.34 18.41,21.34 17.91,20.83 16.64,20.83 16.38,20.57 10.41,20.57 8.38,22.61 8.13,22.61 7.87,22.86 6.99,22.86 5.71,24.13 JP11.2
N$26  (via drill 0.3 pad 0.25)
  Top 0.203: v22.23,23.11 22.23,24.38 U$4.10
  Bottom 0.203: v22.23,23.11 21.84,23.5 19.3,23.5 17.65,21.84 16.64,21.84 15.88,22.61 9.02,22.61 JP11.3
N$27  (via drill 0.3 pad 0.25)
  Top 0.203: JP11.4 12.06,22.1 15.24,22.1 v16,21.34 C16.1 | U$4.11 21.59,23.62 20.83,22.86 v20.83,22.73
  Bottom 0.203: v20.83,22.73 19.18,22.73 17.78,21.34 v16,21.34
N$28
  Top 0.203: 18.41,21.46 17.78,22.1 16.51,22.1 16,22.61 14.1,22.61 JP11.5 | 18.41,21.46 C17.1 18.41,21.46 | 18.41,21.46 20.95,24 20.95,24.38 U$4.12
N$29
  Top 0.203: JP11.6 16.64,22.61 18.92,22.61 20.32,24 20.32,24.38 U$4.13
N$30
  Top 0.203: JP11.7 17.91,24.38 19.56,24.38 U$4.14
N$32
  Top 0.203: R14.2 26.42,20.19 27.3,20.19 27.94,19.56 27.94,18.8 U$1.7
  Top 0.406: C14.1 23.37,15.62 25.4,17.65 R14.2
PA00_XIN32
  Top 0.203: C7.2 26.99,36.07 Y1.2 26.89,35.69 25.61,35.69 IC1.1 25.44,35.52
PA01_XOUT32
  Top 0.203: IC1.2 25.86,36.65 Y1.1 26.35,36.7 C8.2
PA02_AIN0  (via drill 0.3)
  Top 0.203: IC1.3 24.26,35.75 24.26,35.5 23.88,35.12 23.3,35.12 v22.61,35.81
  Bottom 0.203: JP1.2 33.66,40.01 26.86,40.01 v22.61,35.81
PA03_AREFA  (via drill 0.3)
  Top 0.203: C4.1 25.05,37.25 IC1.4 v23.62,35.81
  Bottom 0.203: v23.62,35.81 23.62,36.2 27.05,39.62 37.34,39.62 JP1.1
PA04_AIN4  (via drill 0.3)
  Top 0.203: IC1.9 v21.27,37.02
  Bottom 0.203: JP1.5 27.05,41.91 22.92,37.78 22.04,37.78 v21.27,37.02
PA05_AIN5  (via drill 0.3)
  Top 0.203: v21.4,38.04 21.59,38.03 IC1.10
  Bottom 0.203: JP1.6 21.59,38.04 v21.4,38.04
PA08_TCC0-W0  (via drill 0.3)
  Top 0.203: v19.05,40.64 19.05,39.45 IC1.13
  Bottom 0.203: JP1.10 16.51,40.64 v19.05,40.64
PA09_TCC0-W1  (via drill 0.3)
  Top 0.203: v18.41,40.01 18.41,39.38 IC1.14
  Bottom 0.203: JP1.11 14.61,40.01 v18.41,40.01
PA10_TCC0-W2
  Top 0.203: JP1.9 17.78,39.3 IC1.15
PA11_TCC0-W3
  Top 0.203: IC1.16 18.47,37.91 18.92,37.91 20.32,39.31 JP1.8
PA14_TCC0-W4  (via drill 0.3)
  Top 0.203: IC1.23 15.11,36.31 v15.11,36.51
  Bottom 0.203: JP1.12 11.43,40.64 13.34,40.64 14.29,39.69 14.29,37.34 v15.11,36.51
PA15_TCC0-W5  (via drill 0.3)
  Top 0.203: IC1.24 14.91,35.81 v14.48,35.81
  Bottom 0.203: JP1.13 8.89,40.64 10.79,40.64 11.43,40.01 11.43,38.73 12.06,38.1 13.34,38.1 13.84,37.59 13.84,36.45 v14.48,35.81
PA20_TCC0-W6  (via drill 0.3)
  Top 0.203: IC1.29 15.89,30.92 13.65,30.92 v13.34,31.24
  Bottom 0.203: JP1.14 6.35,40.64 7.68,40.64 8.95,39.37 9.27,38.99 11.43,36.83 11.43,33.85 13.34,31.94 v13.34,31.24
PA28_USB_HOST_EN
  Top 0.203: IC1.41 23.11,30.43 23.11,30.03 23.68,29.46 24.7,29.46 24.94,29.7 R10.2
PA30_SWCLK  (via drill 0.3)
  Top 0.203: IC1.45 23.61,32.77 20.07,32.77 18.54,34.29 11.94,34.29 11.56,33.91 10.41,33.91 v10.03,34.29
  Bottom 0.203: 10.16,36.83 10.1,36.89 | 10.1,36.89 7.94,39.05 3.81,39.05 3.17,38.42 JP4.4 | v10.03,34.29 10.03,36.83 10.1,36.89
PA31_SWDIO  (via drill 0.3)
  Top 0.203: v10.79,34.67 18.73,34.67 20.26,33.15 23.94,33.15 IC1.46
  Bottom 0.203: JP4.2 7.94,39.69 10.79,36.83 v10.79,34.67
PB02_AIN10  (via drill 0.3)
  Top 0.203: v20.32,34.04 20.83,33.53 24.26,33.53 IC1.47
  Bottom 0.203: JP1.7 22.86,40.39 20.32,37.85 v20.32,34.04
PB08_AIN2  (via drill 0.3)
  Top 0.203: IC1.7 22.67,36.99 v22.67,36.77
  Bottom 0.203: JP1.3 31.43,40.39 26.67,40.39 23.05,36.77 v22.67,36.77
PB09_AIN3  (via drill 0.3)
  Top 0.203: IC1.8 21.91,36.94 v21.91,36.45
  Bottom 0.203: JP1.4 29.34,40.77 26.48,40.77 23.11,37.4 22.35,37.4 21.91,36.96 v21.91,36.45
PB10_S4_SPI_MOSI  (via drill 0.3 pad 0.25)
  Top 0.203: IC1.19 16.35,37.91 9.97,37.91 v6.6,34.54
  Bottom 0.203: v6.6,34.54 1.14,29.08 1.14,21.21 2.16,20.19 3.81,20.19 JP3.4
PB11_S4_SPI_SCK  (via drill 0.3 pad 0.25, 0.5 pad 0.25)
  Top 0.203: IC1.20 16.02,37.53 13.4,37.53 13.34,37.47 10.54,37.47 8.13,35.05 v8.13,33.78 | v3.43,25.4 3.43,24.89 3.68,24.64 3.68,23.62 4.95,22.35 JP3.3
  Bottom 0.203: v8.13,33.78 8.13,33.91 3.43,29.21 v3.43,25.4
PB12_S4_SPI_MISO  (via drill 0.3 pad 0.25, 0.5 pad 0.25)
  Top 0.203: v9.4,33.53 9.4,35.18 10.92,36.7 12.19,36.7 12.45,36.96 14.35,36.96 14.48,37.08 15.76,37.08 IC1.21 | v5.97,25.4 5.97,24.89 6.22,24.64 6.22,23.62 7.49,22.35 JP3.1
  Bottom 0.203: v9.4,33.53 6.1,30.23 6.1,27.3 6.22,27.18 6.22,26.16 5.97,25.91 v5.97,25.4
RESET
  Top 0.203: 9.36,30.08 D1.A | D1.A 8.7,29.97 8.52,29.79 8.52,29.34 SW1.2 SW1.4 | R1.1 9.33,30.07 D1.A | R6.2 9.33,29.94 D1.A | JP4.10 2.16,33.91 2.16,30.99 3.98,29.17 SW1.4 | JP3.5 1.14,22.86 1.14,26.29 3.94,29.08 SW1.4
SCK  (via drill 0.3)
  Top 0.203: v17.78,33.02 17.34,33.47 16.31,33.47 IC1.26 14.99,32.14 13.57,32.14 Q2.1
  Bottom 0.203: JP2.7 17.4,29.59 17.4,32.26 17.78,32.64 v17.78,33.02
SCL  (via drill 0.3)
  Top 0.203: IC1.32 v19.03,31.94 | JP2.9 25.4,28.44 R7.1
  Bottom 0.203: JP2.9 23.75,28.32 20.51,28.32 18.8,30.04 18.8,31.62 18.8,31.7 v19.03,31.94
SDA  (via drill 0.3)
  Top 0.203: IC1.31 18.41,32.03 v18.41,32.51 | JP2.8 22.86,28.44 R8.1
  Bottom 0.203: JP2.8 21.59,27.94 20.32,27.94 18.41,29.84 v18.41,32.51
SHIELD  (2 unrouted)
  Top 0.305: 40.67,10.52 J1.S1 40.77,12.51 J1.S5 J1.S6 40.77,17.01 J1.S8
  Top 0.406: L1.1 38.1,19.89 J1.S4 40.67,17.02 J1.S8 | J1.S3 40.67,10.62 J1.S1
SS  (via drill 0.3)
  Top 0.203: IC1.27 15.62,32.07 v15.62,31.56
  Bottom 0.203: JP2.4 12.7,28.64 v15.62,31.56
TARGET_RESET_EDBG
  Top 0.203: R6.1 13.59,28.96 14.61,27.94 21.21,27.94 22.73,29.46 22.73,29.98 IC1.40 22.17,30.67
TARGET_USB_N  (via drill 0.3)
  Top 0.152: J1.2 37.89,13.17 37.72,13.34
  Top 0.203: 37.72,13.34 36.2,13.34 | v20.38,32.19 20.45,32.19 20.45,32.26 19.37,31.3 19.11,31.3 IC1.33
  Top 0.254: 36.2,13.34 v35.94,13.08
  Bottom 0.254: v35.94,13.08 arc45 36.69,13.38 38.01,14.57 arc45 39.98,19.64 39.98,27.15 arc90 34.52,32.74 28.54,32.74 26.89,34.39 22.51,34.39 20.41,32.29 v20.38,32.19
TARGET_USB_P  (via drill 0.3)
  Top 0.152: 37.72,13.72 37.85,13.84 37.97,13.72 J1.3
  Top 0.203: 37.72,13.72 36.2,13.72 v35.94,13.97 | v21.27,32.19 20.18,31.11 19.79,30.87 19.18,30.67 IC1.34
  Bottom 0.203: 21.18,32.23 21.27,32.23 v21.27,32.19
  Bottom 0.254: v35.94,13.97 arc45 37.99,15.33 arc45 39.52,19.84 39.52,27.08 arc90 34.45,32.28 28.35,32.28 26.7,33.93 22.83,33.93 21.24,32.35 21.24,32.29 21.18,32.23
VBUS  (via drill 0.3, 0.5)
  Top 0.152: 37.75,12.54 37.72,12.57
  Top 0.203: C6.1 33.02,32.12 33.02,33.72 R3.1
  Top 0.254: C6.1 34.3,31.55 34.29,31.43
  Top 0.305: JP2.12 32.41,27.26 IC3.8 32.43,29.53 33.59,29.53 34.29,30.23 | 34.29,30.23 34.29,31.43 | IC4.1 34.82,29.69 34.29,30.23
  Top 0.406: v36.58,12.45 36.7,12.57 37.72,12.57 37.85,12.45 38.1,12.45 J1.1 | 34.42,30.61 34.29,31.43
  Top 0.61: v41.66,21.97 41.66,26.04 37.21,30.61 34.42,30.61
  Bottom 0.61: v41.66,21.97 41.66,20.07 42.16,19.56 42.16,14.22 40.39,12.45 v36.58,12.45
VDDANA
  Top 0.203: IC1.6 23.81,37.43 23.81,37.72 L2.2 23.39,38.92 C5.1
VDDCORE
  Top 0.203: IC1.43 23.62,31.37 23.88,31.11 24,31.11 24.26,30.86 24.77,30.86 C11.1
VIN  (via drill 0.3)
  Top 0.305: JP2.14 v36.7,28.07 36.28,28.48 IC4.3 | IC3.6 31.11,28.76 v30.8,28.45
  Bottom 0.305: v36.7,28.07 36.32,28.45 v30.8,28.45
VOUT
  Top 0.203: IC2.1 30.48,37.21 30.92,37.66 31.94,37.66 32.38,37.21 IC2.3 32.46,36.72 | 29.84,33.78 28.45,33.78 28.32,33.91 SJ1.1
  Top 0.305: IC3.7 31.76,27.95 JP2.11 29.84,27.3 29.84,33.78 29.84,35.07 C9.1 | IC2.1 30.49,35.71 C9.1 | C9.1 30.46,35.66

### Text on the board
Top: Mechaduino 0.1 / Joe Church / 3/20/2016
bPlace: 6 | 5 | 4 | 3 | 2 | 1 | 0 | A5 | A4 | A3 | A2 | A1 | A0 | AREF | DAC | SWD | 7 | 8 | 9 | 10 | 11 | 12 | 13 | SDA | SCL | 3V3 | OUT | USB | GND | VIN | W | V | U | VDD | VDD3V | GND | I | GND | SCK | MISO | VREF12 | IN1 | IN2 | IN4 | IN3 | VREF34 | SPI | GND | MOSI | 3V3 | B | A | TEST | MOSI | MISO | CLK | CSN | GND | V+ | 1 | 2 | 3 | OUT 4
tStop: Mechaduino 0.1 / Joe Church / 3/20/2016